# EAGLE design mainboard (EAGLE 6.5.0)
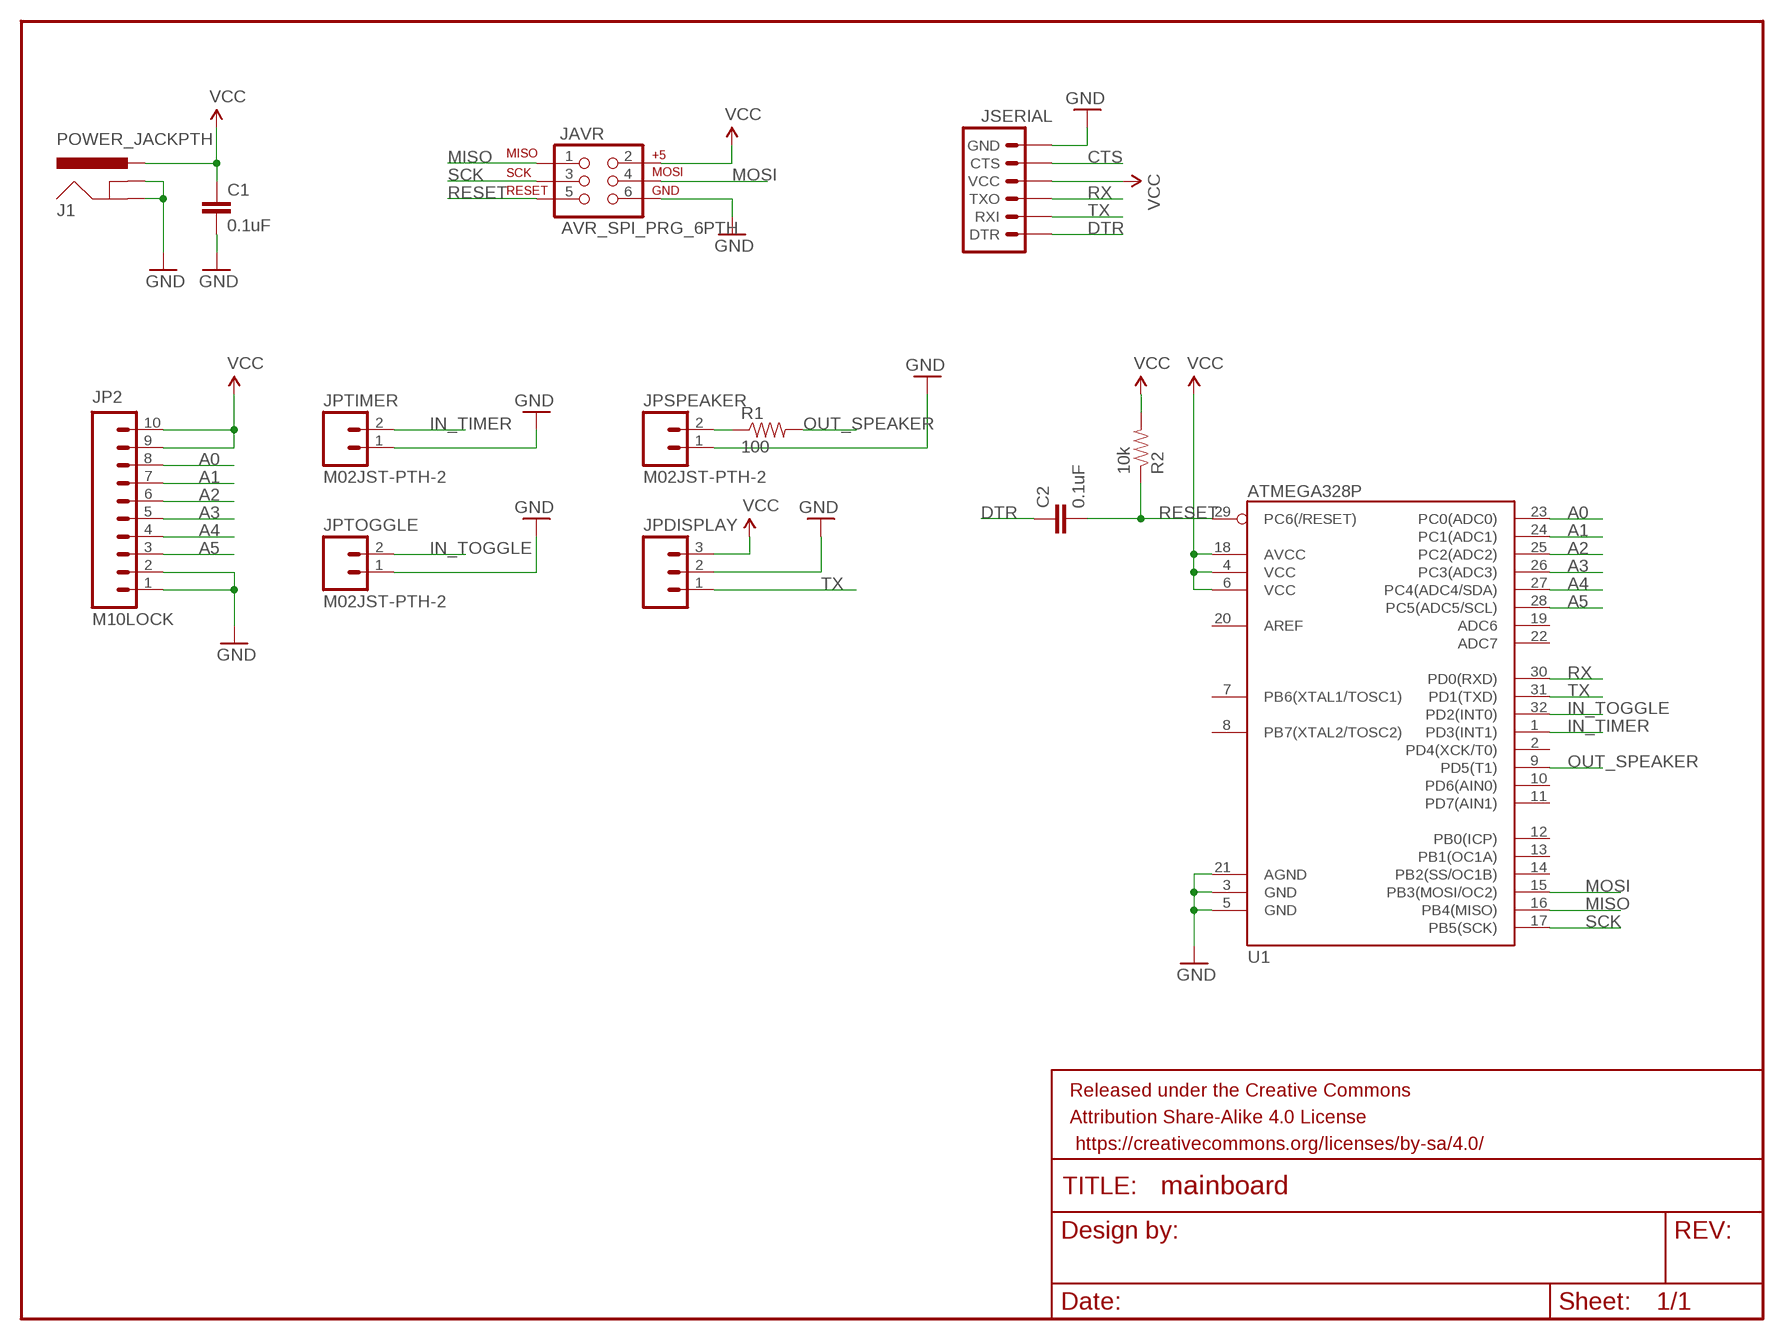
[diagram p0: schematic, sheet 1]

## Parts
C1  0.1uF  0.1UF-25V(+80/-20%)(0603)  [0603-CAP]
C2  0.1uF  0.1UF-25V(+80/-20%)(0603)  [0603-CAP]
FRAME1  FRAME-LETTER  [CREATIVE_COMMONS]
J1  POWER_JACKPTH  [POWER_JACK_PTH]
JAVR  AVR_SPI_PRG_6PTH  [2X3]
JP2  M10LOCK  [1X10_LOCK]
JPDISPLAY  M03JST-PTH  [JST-3-PTH]
JPSPEAKER  M02JST-PTH-2  [JST-2-PTH]
JPTIMER  M02JST-PTH-2  [JST-2-PTH]
JPTOGGLE  M02JST-PTH-2  [JST-2-PTH]
JSERIAL  ARDUINO_SERIAL_PROGRAMPTH  [1X06]
R1  100  RESISTOR0603-RES  [0603-RES]
R2  10k  RESISTOR0603-RES  [0603-RES]
U1  ATMEGA328P  ATMEGA328_SMT  [TQFP32-08]

## Nets
A0: JP2.8 U1.23(PC0(ADC0))
A1: JP2.7 U1.24(PC1(ADC1))
A2: JP2.6 U1.25(PC2(ADC2))
A3: JP2.5 U1.26(PC3(ADC3))
A4: JP2.4 U1.27(PC4(ADC4/SDA))
A5: JP2.3 U1.28(PC5(ADC5/SCL))
CTS: JSERIAL.5(CTS)
DTR: C2.1 JSERIAL.1(DTR)
GND: C1.2 J1.GND J1.GNDBREAK JAVR.6 JP2.1 JP2.2 JPDISPLAY.2 JPSPEAKER.1 JPTIMER.1 JPTOGGLE.1 JSERIAL.6(GND) U1.3(GND) U1.5(GND) U1.21(AGND)
IN_TIMER: JPTIMER.2 U1.1(PD3(INT1))
IN_TOGGLE: JPTOGGLE.2 U1.32(PD2(INT0))
MISO: JAVR.1 U1.16(PB4(MISO))
MOSI: JAVR.4 U1.15(PB3(MOSI/OC2))
N$1: JPSPEAKER.2 R1.1
OUT_SPEAKER: R1.2 U1.9(PD5(T1))
RESET: C2.2 JAVR.5 R2.1 U1.29(PC6(/RESET))
RX: JSERIAL.3(TXO) U1.30(PD0(RXD))
SCK: JAVR.3 U1.17(PB5(SCK))
TX: JPDISPLAY.1 JSERIAL.2(RXI) U1.31(PD1(TXD))
VCC: C1.1 J1.PWR JAVR.2 JP2.9 JP2.10 JPDISPLAY.3 JSERIAL.4(VCC) R2.2 U1.4(VCC) U1.6(VCC) U1.18(AVCC)
Unconnected: U1.2(PD4(XCK/T0)) U1.7(PB6(XTAL1/TOSC1)) U1.8(PB7(XTAL2/TOSC2)) U1.10(PD6(AIN0)) U1.11(PD7(AIN1)) U1.12(PB0(ICP)) U1.13(PB1(OC1A)) U1.14(PB2(SS/OC1B)) U1.19(ADC6) U1.20(AREF) U1.22(ADC7)

## Library data of the parts
C1 C2 = SparkFun-Capacitors:0.1UF-25V(+80/-20%)(0603): CAP-00810 Ceramic Standard decoupling cap; PROD_ID: CAP-00810
FRAME1 = SparkFun-Aesthetics:FRAME-LETTER: Schematic Frame Standard 8.5x11 US Letter frame
J1 = SparkFun-Connectors:POWER_JACK: Power Jack This is the standard 5.5mm barrel jack for power. The PTH is the most common, proven, reliable, footprint. The Slot footprint only works if the mill layer is transmitted to the PCB fab house so be warned. Mating wall wart : TOL-00298 (and others); PROD_ID: PRT-00119
JAVR = SparkFun-Connectors:AVR_SPI_PRG_6: AVR ISP 6 Pin This is the reduced ISP connector for AVR programming. Common on Arduino. This footprint will take up less PCB space and can be used with a 10-pin to 6-pin adapter such as SKU: BOB-08508
JP2 = SparkFun-Connectors:M10: Header 10 Standard 10-pin 0.1" header. Use with straight break away headers (SKU : PRT-00116), right angle break away headers (PRT-00553), swiss pins (PRT-00743), machine pins (PRT-00117), and female headers (PRT-00115).
JPDISPLAY = SparkFun-Connectors:M03: Header 3 Standard 3-pin 0.1" header. Use with straight break away headers (SKU : PRT-00116), right angle break away headers (PRT-00553), swiss pins (PRT-00743), machine pins (PRT-00117), and female headers (PRT-00115). Molex polarized connector foot print use with SKU : PRT-08232 with associated crimp pins and housings.; SKU: PRT-09915
JPSPEAKER JPTIMER JPTOGGLE = SparkFun-Connectors:M02: Standard 2-pin 0.1" header. Use with - straight break away headers ( PRT-00116) - right angle break away headers (PRT-00553) - swiss pins (PRT-00743) - machine pins (PRT-00117) - female headers (PRT-00115) Molex polarized connector foot print use with: PRT-08233 with associated crimp pins and housings. 2.54_SCREWTERM for use with PRT-10571. 3.5mm Screw Terminal footprints for PRT-08084 5mm Screw Terminal footprints for use with PRT-08433; SKU: PRT-09914
JSERIAL = SparkFun-Connectors:ARDUINO_SERIAL_PROGRAM: FTDI connector footprints
R1 R2 = SparkFun-Passives:RESISTOR: Resistor Basic schematic elements and footprints for 0603, 1206, and PTH resistors.
U1 = SparkFun-DigitalIC:ATMEGA328_SMT: 32-Pin Atmega328 part Commonly used on Arduino compatible boards Available in QFP and QFN packages TQFP is IC-09069 QFN is non-stock; PROD_ID: IC-09069

## Board
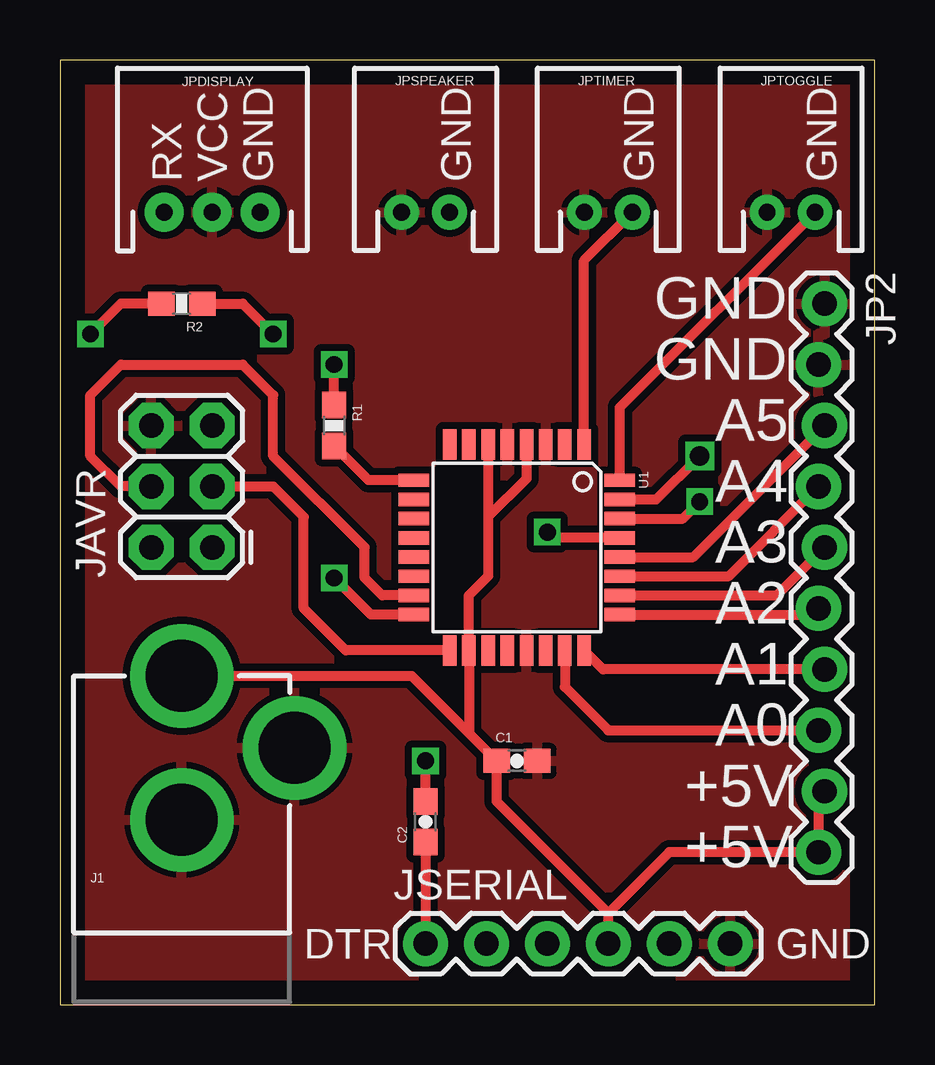
[diagram p1: board, top side]
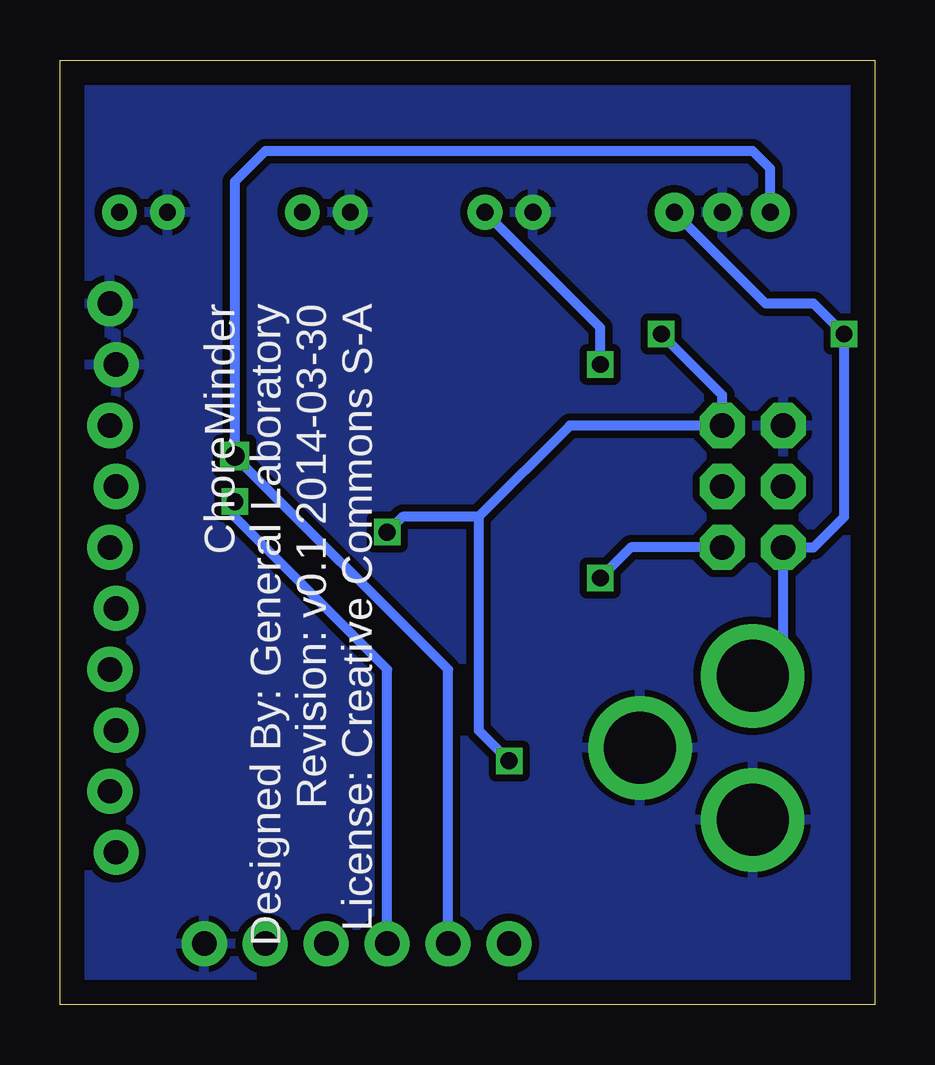
[diagram p2: board, bottom side, seen from below]

Size 33.96 x 39.36 mm. Coordinates in mm from the lower left corner, seen from the top.
Outline: 0,0 33.96,0 33.96,39.36 0,39.36 0,0
Copper layers (1*16): Top 0.035mm / dielectric 1.5mm / Bottom 0.035mm
Design rules "default *": minimum track width 10mil, minimum drill 24mil, track to track 8mil, track to pad 8mil, pad to pad 8mil, via to via 8mil, smd to smd 8mil, copper to edge 40mil, drill to drill 8mil, minimum pad ring 10mil, minimum via ring 8mil, stop-mask expansion 4mil, vias tented up to drill 27mil, thermal gap 10mil

### Footprints (pad centres in the part's own frame; a part is rotated, then mirrored left to right if it is on the bottom)
0603-CAP = smd 1.1 x 1: 1 -0.85,0; 2 0.85,0
POWER_JACK_PTH = drill 2.997 pad 4.318: GND 0,7.7; GNDBREAK 4.7,10.7; PWR 0,13.7
2X3 = drill 1.016 pad 1.88 octagon: 1 0,0; 2 0,2.54; 3 2.54,0; 4 2.54,2.54; 5 5.08,0; 6 5.08,2.54
1X10_LOCK = drill 1.016 pad 1.88: 1 0,0.127; 2 2.54,-0.127; 3 5.08,0.127; 4 7.62,-0.127; 5 10.16,0.127; 6 12.7,-0.127; 7 15.24,0.127; 8 17.78,-0.127; 9 20.32,0.127; 10 22.86,-0.127
JST-3-PTH = drill 0.7 pad 1.626: 1 -2,0; 2 0,0; 3 2,0
JST-2-PTH = drill 0.7 pad 1.448: 1 -1,0; 2 1,0
1X06 = drill 1.016 pad 1.88: 1 0,0; 2 2.54,0; 3 5.08,0; 4 7.62,0; 5 10.16,0; 6 12.7,0
0603-RES = smd 1.1 x 1: 1 -0.85,0; 2 0.85,0
TQFP32-08 = smd 1.27 x 0.559: 1 -4.293,2.8; 2 -4.293,2; 3 -4.293,1.2; 4 -4.293,0.4; 5 -4.293,-0.4; 6 -4.293,-1.2; 7 -4.293,-2; 8 -4.293,-2.8; 17 4.293,-2.8; 18 4.293,-2; 19 4.293,-1.2; 20 4.293,-0.4; 21 4.293,0.4; 22 4.293,1.2; 23 4.293,2; 24 4.293,2.8 | smd 0.559 x 1.27: 9 -2.8,-4.293; 10 -2,-4.293; 11 -1.2,-4.293; 12 -0.4,-4.293; 13 0.4,-4.293; 14 1.2,-4.293; 15 2,-4.293; 16 2.8,-4.293; 25 2.8,4.293; 26 2,4.293; 27 1.2,4.293; 28 0.4,4.293; 29 -0.4,4.293; 30 -1.2,4.293; 31 -2,4.293; 32 -2.8,4.293

### Placement (x,y rotation side)
C1  19.05,10.16 0 top
C2  15.24,7.62 90 top
FRAME1  -59.69,20.32 0 top  (outside the outline)
J1  5.08,0 0 top
JAVR  6.35,19.05 90 top
JP2  31.75,29.21 270 top
JPDISPLAY  6.35,33.02 0 top
JPSPEAKER  15.24,33.02 0 top
JPTIMER  22.86,33.02 0 top
JPTOGGLE  30.48,33.02 0 top
JSERIAL  15.24,2.54 0 top
R1  11.43,24.13 270 top
R2  5.08,29.21 180 top
U1  19.05,19.05 270 top

### Tracks (layer width: path | path; a pad name or v marks a point on that pad's centre or on a via)
A0
  Top 0.406: U1.23 21.05,13.24 22.86,11.43 JP2.8
A1
  Top 0.406: JP2.7 22.64,13.97 U1.24
A2
  Top 0.406: U1.25 31.36,16.25 JP2.6
A3
  Top 0.406: U1.26 29.88,17.05 JP2.5
A4
  Top 0.406: U1.27 27.88,17.85 JP2.4
A5
  Top 0.406: U1.28 26.4,18.65 JP2.3
DTR
  Top 0.406: C2.1 JSERIAL.1
GND
  pour Bottom (isolate 0.305): -1.27,-1.27 35.56,-1.27 35.56,40.64 -1.27,40.64
  pour Top (isolate 0.305): -2.54,-2.54 36.83,-2.54 36.83,41.91 -2.54,41.91
IN_TIMER
  Top 0.406: U1.1 21.85,31.01 JPTIMER.2
IN_TOGGLE
  Top 0.406: U1.32 23.34,24.88 JPTOGGLE.2
MISO  (via drill 0.7)
  Top 0.406: U1.16 12.96,16.25 v11.43,17.78
  Bottom 0.406: JAVR.1 10.16,19.05 v11.43,17.78
MOSI
  Top 0.406: U1.15 13.43,17.05 12.7,17.78 12.7,19.05 8.89,22.86 8.89,25.4 7.62,26.67 2.54,26.67 1.27,25.4 1.27,22.86 2.54,21.59 JAVR.4
N$1  (via drill 0.7)
  Top 0.406: R1.1 v11.43,26.67
  Bottom 0.406: v11.43,26.67 11.43,28.21 JPSPEAKER.2
OUT_SPEAKER
  Top 0.406: U1.9 12.86,21.85 R1.2
RESET  (via drill 0.6, 0.7)
  Top 0.406: U1.29 20.55,19.45 v20.32,19.68 | C2.2 v15.24,10.16 | R2.1 7.62,29.21 v8.89,27.94
  Bottom 0.406: 16.51,20.32 12.7,24.13 JAVR.5 6.35,25.4 v8.89,27.94 | 16.51,20.32 19.68,20.32 v20.32,19.68 | 16.51,20.32 16.51,11.43 v15.24,10.16
RX  (via drill 0.7)
  Top 0.406: U1.30 25.96,20.25 v26.67,20.95
  Bottom 0.406: JSERIAL.3 20.32,13.97 26.67,20.32 v26.67,20.95
SCK
  Top 0.406: JAVR.3 8.89,21.59 10.16,20.32 10.16,16.51 11.91,14.76 U1.17
TX  (via drill 0.7, 0.8)
  Top 0.406: U1.31 24.86,21.05 v26.67,22.86
  Bottom 0.406: JPDISPLAY.1 4.35,34.83 5.08,35.56 25.4,35.56 26.67,34.29 v26.67,22.86 17.78,13.97 JSERIAL.2
VCC  (via drill 0.6, 0.7)
  Top 0.406: JP2.9 31.62,8.64 JP2.10 25.4,6.35 22.86,3.81 | 17.85,21.52 U1.6 17.85,20.32 | 17.85,20.32 17.85,17.85 17.05,17.05 U1.18 17.05,11.31 | U1.4 19.45,21.92 17.85,20.32 | 17.05,11.31 C1.1 18.2,8.47 22.86,3.81 | JSERIAL.4 22.86,3.81 | J1.PWR 14.66,13.7 17.05,11.31 | R2.2 2.54,29.21 v1.27,27.94
  Bottom 0.406: J1.PWR 3.81,14.97 JAVR.2 2.54,19.05 1.27,20.32 v1.27,27.94 2.54,29.21 4.54,29.21 JPDISPLAY.3

### Text on the board
tNames: RX | VCC | GND | GND | GND | GND | GND | GND | A5 | A4 | A3 | A2 | A1 | A0 | +5V | +5V | DTR | GND
bNames: ChoreMinder / Designed By: General Laboratory / Revision: v0.1 2014-03-30 / License: Creative Commons S-A